# Altium schematic sheet Sheet3.SchDoc
size A4
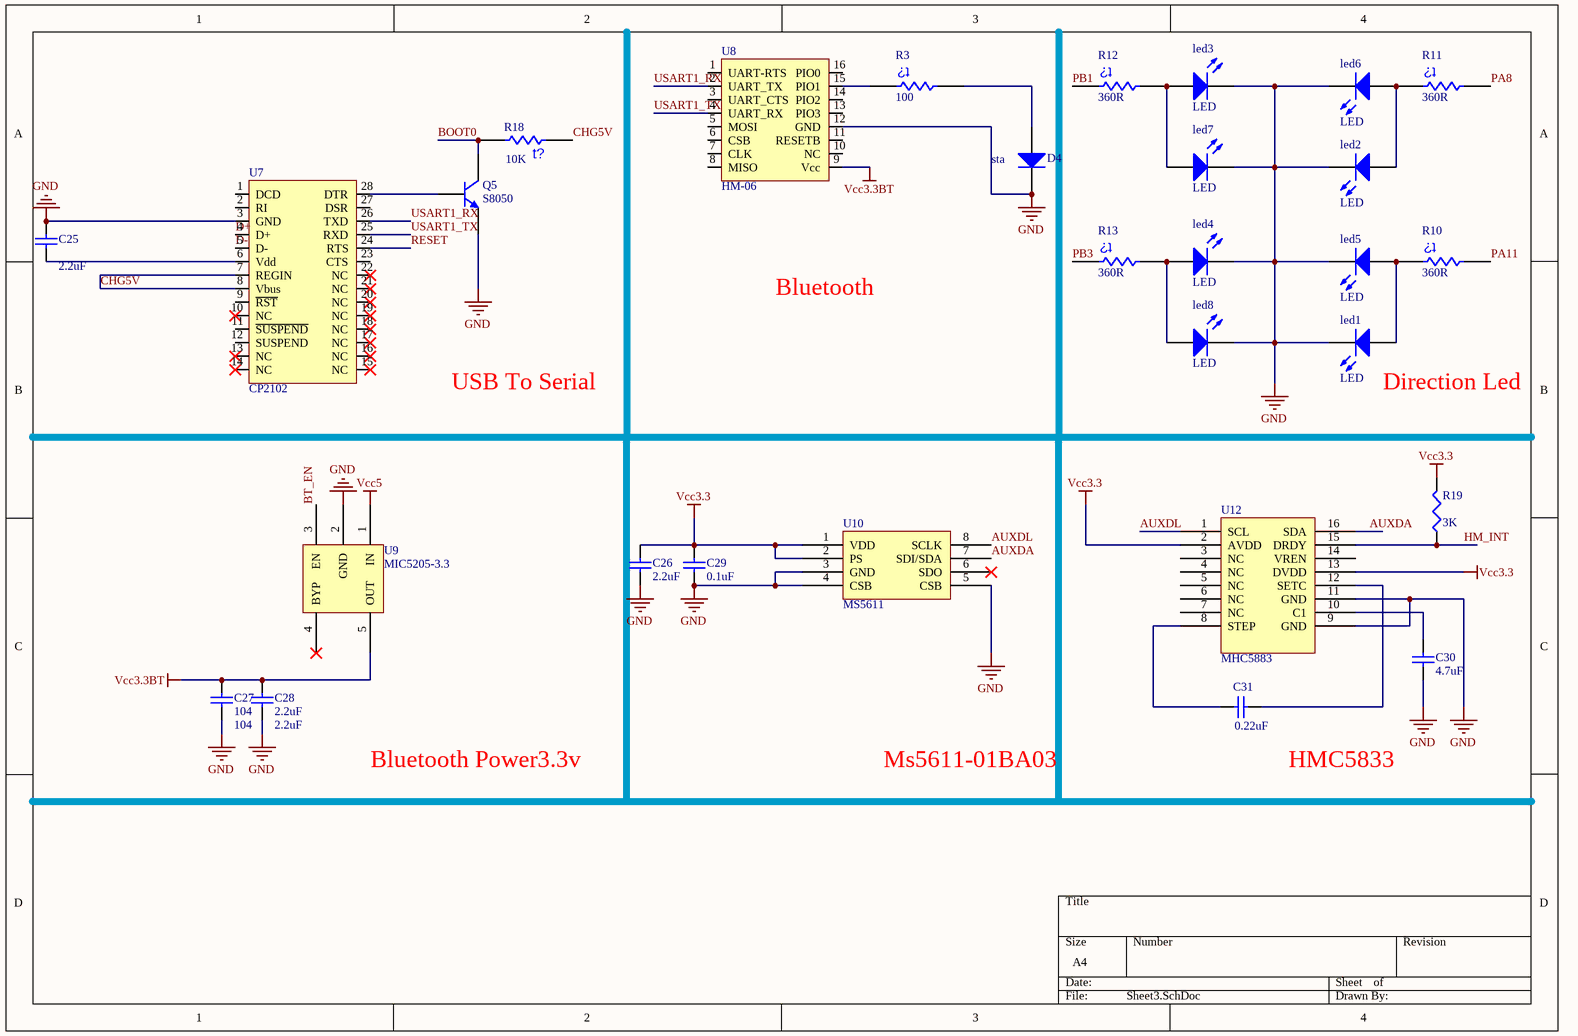
[diagram p0: Sheet3.SchDoc]

## Parts
C25  2.2uF  [1608[0603]]
C26  2.2uF  [1608[0603]]
C27  104  [1608[0603]]
C28  2.2uF  [1608[0603]]
C29  0.1uF  [1608[0603]]
C30  4.7uF  [1608[0603]]
C31  0.22uF  [1608[0603]]
D4  sta  [6-0805_N]
led1  LED  [6-0805_N]
led2  LED  [6-0805_N]
led3  LED  [6-0805_N]
led4  LED  [6-0805_N]
led5  LED  [6-0805_N]
led6  LED  [6-0805_N]
led7  LED  [6-0805_N]
led8  LED  [6-0805_N]
Q5  S8050  [SOT-23B_N]
R3  100  [6-0805_N]
R10  360R  [6-0805_N]
R11  360R  [6-0805_N]
R12  360R  [6-0805_N]
R13  360R  [6-0805_N]
R18  10K  [6-0805_N]
R19  3K  [0805]
U7  CP2102  [cp2102]
U8  HM-06  [HM-11]
U9  MIC5205-3.3  [SOT95P280X120-5N]
U10  MS5611  [U6 - duplicate1]  (value not drawn)
U12  HMC5833  [QFN50P302X302X90-16N]  (value not drawn)

## Nets
GND: C25.1 C26.1 C27.2 C28.2 C29.1 C30.1 D4.2(K) led1.2(K) led2.2(K) led3.2(K) led4.2(K) led5.2(K) led6.2(K) led7.2(K) led8.2(K) Q5.3(E) U7.3(GND) U8.12(GND) U9.2(GND) U10.3(GND) U10.4(CSB) U10.5(CSB) U12.9(GND) U12.11(GND)
Vcc3.3: C26.2 C29.2 R19.2 U10.1(VDD) U10.2(PS) U12.2(AVDD) U12.13(DVDD)
Vcc3.3BT: C27.1 C28.1 U8.9(Vcc) U9.5(OUT)
Vcc5: U9.1(IN)
AUXDA: U10.7(SDI/SDA) U12.16(SDA)
AUXDL: U10.8(SCLK) U12.1(SCL)
BOOT0: Q5.1(C) R18.2
BT_EN: U9.3(EN)
CHG5V: R18.1 U7.7(REGIN) U7.8(Vbus)
D+: U7.4(D+)
D-: U7.5(D-)
HM_INT: R19.1 U12.15(DRDY)
PA8: R11.2
PA11: R10.2
PB1: R12.1
PB3: R13.1
RESET: U7.24(RTS)
USART1_RX: U7.26(TXD) U8.2(UART_TX)
USART1_TX: U7.25(RXD) U8.4(UART_RX)
NetC25_2: C25.2 U7.6(Vdd)
NetC30_2: C30.2 U12.10(C1)
NetC31_1: C31.1 U12.8(STEP)
NetC31_2: C31.2 U12.12(SETC)
NetD4_1: D4.1(A) R3.2
Netled1_1: led1.1(A) led5.1(A) R10.1
Netled2_1: led2.1(A) led6.1(A) R11.1
Netled3_1: led3.1(A) led7.1(A) R12.2
Netled4_1: led4.1(A) led8.1(A) R13.2
NetQ5_2: Q5.2(B) U7.28(DTR)
NetR3_1: R3.1 U8.15(PIO1)

Not connected (* = marked no-connect by the designer): U7 1(DCD) 2(RI) 9(~{RST}) 10(NC)* 11(~{SUSPEND}) 12(SUSPEND) 13(NC)* 14(NC)* 15(NC)* 16(NC)* 17(NC)* 18(NC)* 19(NC)* 20(NC)* 21(NC)* 22(NC)* 23(CTS) 27(DSR); U8 1(UART-RTS) 3(UART_CTS) 5(MOSI) 6(CSB) 7(CLK) 8(MISO) 10(NC) 11(RESETB) 13(PIO3) 14(PIO2) 16(PIO0); U9 4(BYP)*; U10 6(SDO)*; U12 3(NC) 4(NC) 5(NC) 6(NC) 7(NC) 14(VREN)

## Notes on the sheet
- Labels drawn without touching a wire or pin: Bluetooth, Bluetooth Power3.3v, Direction Led, HMC5833, Ms5611-01BA03, USB To Serial
- (in symbol Component_1) MHC5883
- (in symbol Res Thermal) t?

## Library data of the parts
C25-C31 = Cap Semi: Capacitor (Semiconductor SIM Model); Published: 8-Jun-2000; LatestRevisionDate: 29-May-2009; LatestRevisionNote: IPC-7351 Footprint Added.; PackageReference: C1206; Publisher: Altium Limited; PackageDescription: Chip Capacitor
  C25 C26 C28: Value: 2.2uF
  C27: Value: 104
  C29: Value: 0.1uF
  C30: Value: 4.7uF
  C31: Value: 0.22uF
D4 = Diode: Default Diode; Published: 8-Jun-2000; LatestRevisionDate: 17-Jul-2002; LatestRevisionNote: Re-released for DXP Platform.; PackageVersion: Sep-1996; PackageReference: SMC; Publisher: Altium Limited; PackageDescription: DO-214-AB/SMC; 2 C-Bend Leads; Body 7.9 x 5.9 mm, inc. leads (LxW); Code_JEDEC: DO-214-AB
led1-led8 = LED2: Typical RED, GREEN, YELLOW, AMBER GaAs LED; Published: 8-Jun-2000; LatestRevisionDate: 17-Jul-2002; LatestRevisionNote: Re-released for DXP Platform.; PackageVersion: Feb-2002; PackageReference: 3.2X1.6X1.1; Publisher: Altium Limited; PackageDescription: SM LED; 2 Flat Leads
Q5 = QNPN: NPN Bipolar Transistor; Published: 8-Jun-2000; LatestRevisionDate: 29-May-2009; LatestRevisionNote: IPC-7351 Footprint Added.; PackageVersion: Aug-1999; PackageReference: SOT-23B; Publisher: Altium Limited; PackageDescription: 3-Pin SOT-23 Package 0.95 mm Pitch, 2.4 mm Lead Span
R3 = Res Thermal: value: 100K; Published: 24-Mar-1999; LatestRevisionDate: 29-May-2009; LatestRevisionNote: IPC-7351 Footprint Added.; PackageVersion: Mar-2003; PackageReference: 6-0805; Publisher: Altium Limited; PackageDescription: Chip Resistor 0805 Case Size; Code_IPC: RESC2012
R10-R13 = Res Thermal: value: 360K; Published: 24-Mar-1999; LatestRevisionDate: 29-May-2009; LatestRevisionNote: IPC-7351 Footprint Added.; PackageVersion: Mar-2003; PackageReference: 6-0805; Publisher: Altium Limited; PackageDescription: Chip Resistor 0805 Case Size; Code_IPC: RESC2012
R18 = Res Thermal: Published: 24-Mar-1999; LatestRevisionDate: 29-May-2009; LatestRevisionNote: IPC-7351 Footprint Added.; PackageVersion: Mar-2003; PackageReference: 6-0805; Publisher: Altium Limited; PackageDescription: Chip Resistor 0805 Case Size; Code_IPC: RESC2012; value: 10K
R19 = Res3: Resistor; Published: 8-Jun-2000; LatestRevisionDate: 04-Mar-2005; LatestRevisionNote: PCB Footprint replaced.; PackageReference: J1-0603; Publisher: Altium Limited; Value: 3K
U8 = bluetooth
U10 U12 = Component_1